# EAGLE schematic stl_mainboard (EAGLE 7.7.0)
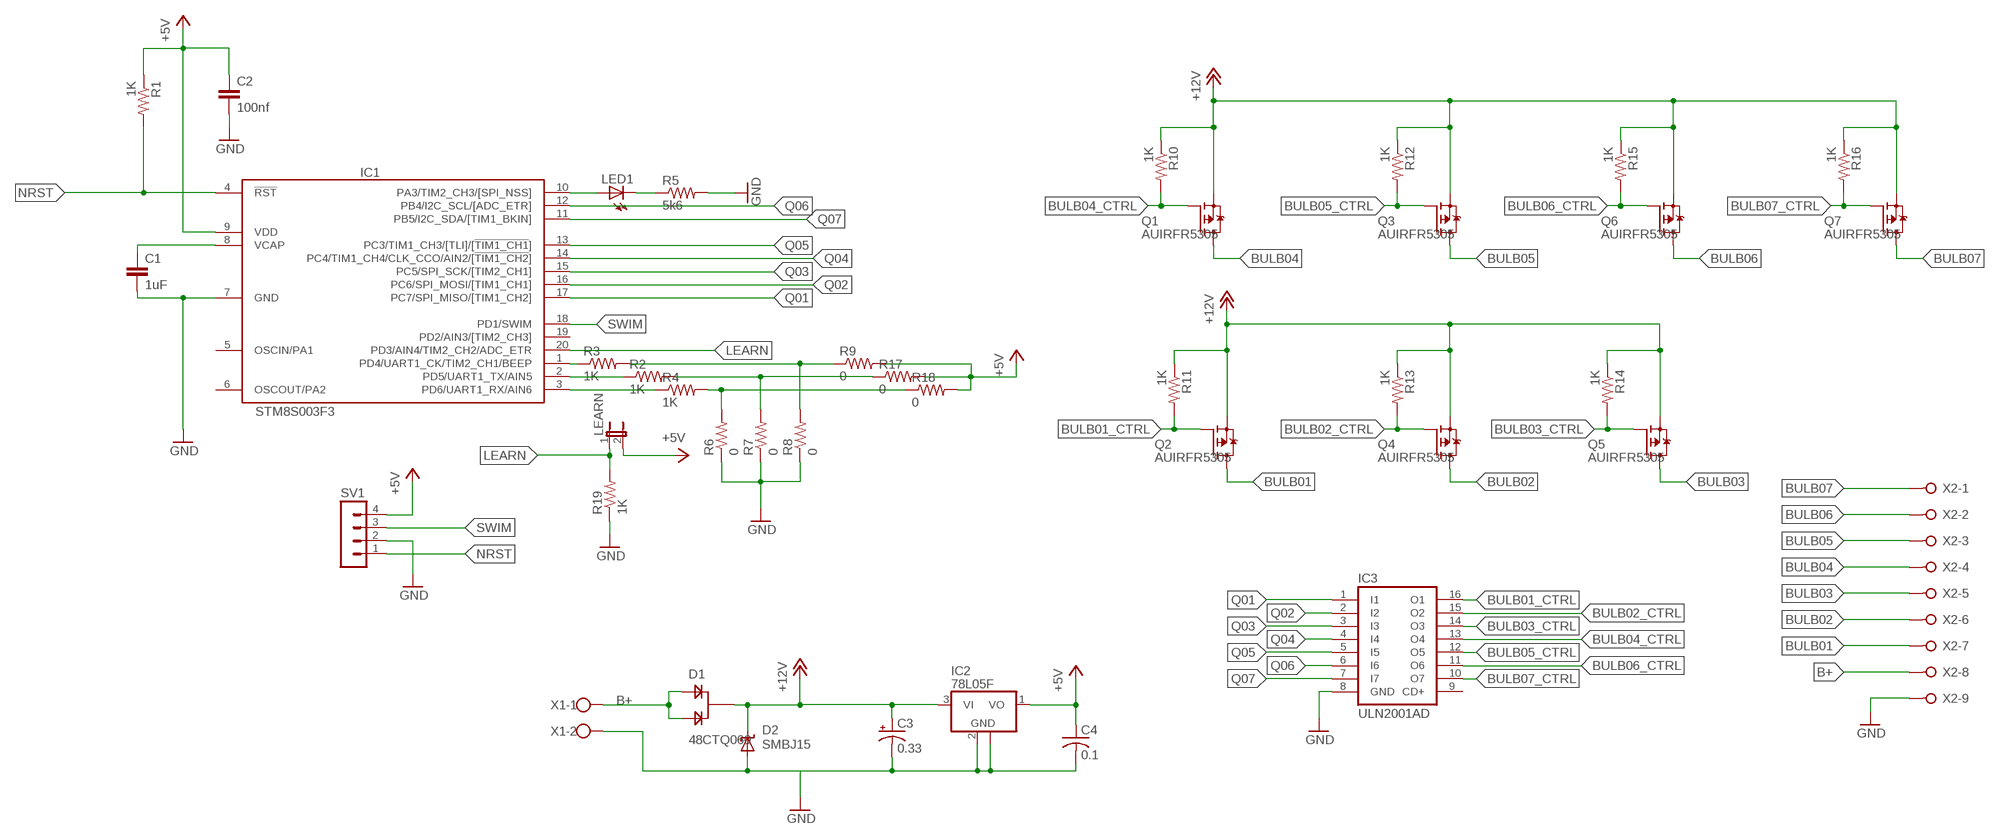
[diagram p0: schematic, sheet 1]

## Parts
C1  1uF  C-EUC1206  [C1206]
C2  100nf  C-EUC1206  [C1206]
C3  0.33  CPOL-USE5-8.5  [E5-8,5]
C4  0.1  C-USC0805  [C0805]
D1  48CTQ060  [TO263AB]
D2  SMBJ15  SUPPRESSOR-SMBJ  [SMBJ]
IC1  STM8S003F3  [TSSOP20]
IC2  78L05F  [SOT89]
IC3  ULN2001AD  [SO16]
LEARN  JP1E  [JP1]
LED1  LEDSML1206  [SML1206]
Q1  AUIRFR5305  SPD30P06PTO252  [TO252]
Q2  AUIRFR5305  SPD30P06PTO252  [TO252]
Q3  AUIRFR5305  SPD30P06PTO252  [TO252]
Q4  AUIRFR5305  SPD30P06PTO252  [TO252]
Q5  AUIRFR5305  SPD30P06PTO252  [TO252]
Q6  AUIRFR5305  SPD30P06PTO252  [TO252]
Q7  AUIRFR5305  SPD30P06PTO252  [TO252]
R1  1K  R-US_M0805  [M0805]
R2  1K  R-US_M0805  [M0805]
R3  1K  R-US_M0805  [M0805]
R4  1K  R-US_M0805  [M0805]
R5  5k6  R-US_M0805  [M0805]
R6  0  R-US_M0805  [M0805]
R7  0  R-US_M0805  [M0805]
R8  0  R-US_M0805  [M0805]
R9  0  R-US_M0805  [M0805]
R10  1K  R-US_M0805  [M0805]
R11  1K  R-US_M0805  [M0805]
R12  1K  R-US_M0805  [M0805]
R13  1K  R-US_M0805  [M0805]
R14  1K  R-US_M0805  [M0805]
R15  1K  R-US_M0805  [M0805]
R16  1K  R-US_M0805  [M0805]
R17  0  R-US_M0805  [M0805]
R18  0  R-US_M0805  [M0805]
R19  1K  R-US_M0805  [M0805]
SV1  MA04-1  [MA04-1]
X1  W237-102  [W237-102]
X2  W237-09P  [W237-9P]

## Nets
+5V: C2.1 C4.1 IC1.9(VDD) IC2.1(VO) LEARN.2 R1.1 R9.2 R17.2 R18.2 SV1.4
B+: D1.1 D1.2 X1.1 X2.8
BULB01: Q2.3(D) X2.7
BULB01_CTRL: IC3.16(O1) Q2.1(G) R11.2
BULB02: Q4.3(D) X2.6
BULB02_CTRL: IC3.15(O2) Q4.1(G) R13.2
BULB03: Q5.3(D) X2.5
BULB03_CTRL: IC3.14(O3) Q5.1(G) R14.2
BULB04: Q1.3(D) X2.4
BULB04_CTRL: IC3.13(O4) Q1.1(G) R10.2
BULB05: Q3.3(D) X2.3
BULB05_CTRL: IC3.12(O5) Q3.1(G) R12.2
BULB06: Q6.3(D) X2.2
BULB06_CTRL: IC3.11(O6) Q6.1(G) R15.2
BULB07: Q7.3(D) X2.1
BULB07_CTRL: IC3.10(O7) Q7.1(G) R16.2
GND: C1.2 C2.2 C3.- C4.2 D2.A IC1.7(GND) IC2.2(GND) IC2.2@1(GND) IC3.8(GND) R5.2 R6.1 R7.1 R8.1 R19.1 SV1.2 X1.2 X2.9
LEARN: IC1.20(PD3/AIN4/TIM2_CH2/ADC_ETR) LEARN.1 R19.2
N$1: IC1.10(PA3/TIM2_CH3/[SPI_NSS]) LED1.A
N$2: LED1.C R5.1
N$3: C1.1 IC1.8(VCAP)
N$5: IC1.1(PD4/UART1_CK/TIM2_CH1/BEEP) R3.1
N$6: IC1.2(PD5/UART1_TX/AIN5) R2.1
N$7: IC1.3(PD6/UART1_RX/AIN6) R4.1
N$8: R3.2 R8.2 R9.1
N$9: R2.2 R7.2 R17.1
N$10: R4.2 R6.2 R18.1
NRST: IC1.4(!RST) R1.2 SV1.1
Q01: IC1.17(PC7/SPI_MISO/[TIM1_CH2]) IC3.1(I1)
Q02: IC1.16(PC6/SPI_MOSI/[TIM1_CH1]) IC3.2(I2)
Q03: IC1.15(PC5/SPI_SCK/[TIM2_CH1]) IC3.3(I3)
Q04: IC1.14(PC4/TIM1_CH4/CLK_CCO/AIN2/[!TIM1_CH2!]) IC3.4(I4)
Q05: IC1.13(PC3/TIM1_CH3/[TLI]/[!TIM1_CH1!]) IC3.5(I5)
Q06: IC1.12(PB4/I2C_SCL/[ADC_ETR]) IC3.6(I6)
Q07: IC1.11(PB5/I2C_SDA/[TIM1_BKIN]) IC3.7(I7)
SWIM: IC1.18(PD1/SWIM) SV1.3
VDD: C3.+ D1.K D2.C IC2.3(VI) Q1.2(S) Q2.2(S) Q3.2(S) Q4.2(S) Q5.2(S) Q6.2(S) Q7.2(S) R10.1 R11.1 R12.1 R13.1 R14.1 R15.1 R16.1 ; supply symbol labelled +12V
Unconnected: IC1.5(OSCIN/PA1) IC1.6(OSCOUT/PA2) IC1.19(PD2/AIN3/[TIM2_CH3]) IC3.9(CD+)

## Library data of the parts
C1 C2 = rcl:C-EU: CAPACITOR, European symbol
C3 = rcl:CPOL-US: POLARIZED CAPACITOR, American symbol
C4 = rcl:C-US: CAPACITOR, American symbol
D1 = 48ctq060:48CTQ060
D2 = diode:SUPPRESSOR-: Suppressor diode
IC1 = stm8:STM8S003: Value line, 16 MHz STM8S 8-bit MCU, 8 Kbytes Flash, 128 bytes data EEPROM, 10-bit ADC, 3 timers, UART, SPI, I2C
IC2 = linear:78L*: POSITOIV-VOLTAGE REGULATORS Output up to 100 mA Source: Datasheet <http://focus.ti.com/lit/ds/symlink/ua78l05.pdf>
IC3 = uln-udn:ULN2001A: DRIVER ARRAY
LEARN = jumper:JP1E: JUMPER
LED1 = led:LED: LED OSRAM: - CHIPLED LG R971, LG N971, LY N971, LG Q971, LY Q971, LO R971, LY R971 LH N974, LH R974 LS Q976, LO Q976, LY Q976 LO Q996 - Hyper CHIPLED LW Q18S LB Q993, LB Q99A, LB R99A - SideLED LS A670, LO A670, LY A670, LG A670, LP A670 LB A673, LV A673, LT A673, LW A673 LH A674 LY A675 LS A676, LA A676, LO A676, LY A676, LW A676 LS A679, LY A679, LG A679 - Hyper Micro SIDELED® LS Y876, LA Y876, LO Y876, LY Y876 LT Y87S - SmartLED LW L88C, LW L88S LB L89C, LB L89S, LG L890 LS L89K, LO L89K, LY L89K LS L896, LA L896, LO L896, LY L896 - TOPLED LS T670, LO T670, LY T670, LG T670, LP T670 LSG T670, LSP T670, LSY T670, LOP T670, LYG T670 LG T671, LOG T671, LSG T671 LB T673, LV T673, LT T673, LW T673 LH T674 LS T676, LA T676, LO T676, LY T676, LB T676, LH T676, LSB T676, LW T676 LB T67C, LV T67C, LT T67C, LS T67K, LO T67K, LY T67K, LW E67C LS E67B, LA E67B, LO E67B, LY E67B, LB E67C, LV E67C, LT E67C LW T67C LS T679, LY T679, LG T679 LS T770, LO T770, LY T770, LG T770, LP T770 LB T773, LV T773, LT T773, LW T773 LH T774 LS E675, LA E675, LY E675, LS T675 LS T776, LA T776, LO T776, LY T776, LB T776 LHGB T686 LT T68C, LB T68C - Hyper Mini TOPLED® LB M676 - Mini TOPLED Santana® LG M470 LS M47K, LO M47K, LY M47K Source: http://www.osram.convergy.de LUXEON: - LUMILED® LXK2-PW12-R00, LXK2-PW12-S00, LXK2-PW14-U00, LXK2-PW14-V00 LXK2-PM12-R00, LXK2-PM12-S00, LXK2-PM14-U00 LXK2-PE12-Q00, LXK2-PE12-R00, LXK2-PE12-S00, LXK2-PE14-T00, LXK2-PE14-U00 LXK2-PB12-K00, LXK2-PB12-L00, LXK2-PB12-M00, LXK2-PB14-N00, LXK2-PB14-P00, LXK2-PB14-Q00 LXK2-PR12-L00, LXK2-PR12-M00, LXK2-PR14-Q00, LXK2-PR14-R00 LXK2-PD12-Q00, LXK2-PD12-R00, LXK2-PD12-S00 LXK2-PH12-R00, LXK2-PH12-S00 LXK2-PL12-P00, LXK2-PL12-Q00, LXK2-PL12-R00 Source: www.luxeon.com KINGBRIGHT: KA-3528ASYC Source: www.kingbright.com
Q1-Q7 = transistor-fet:SPD30P06P: SIPMOS(R) Power-Transistor P-Channel, Enhancement mode Source: http://www.infineon.com/upload/Document/cmc_upload/documents/012/3615/SPD_U30P06P.pdf
R1-R19 = rcl:R-US_: RESISTOR, American symbol
SV1 = con-lstb:MA04-1: PIN HEADER; OC_FARNELL: unknown; OC_NEWARK: unknown
X1 = con-wago-500:W237-102: WAGO SCREW CLAMP; MPN: 237-102; OC_FARNELL: unknown; OC_NEWARK: 70K9898
X2 = con-wago-508:W237-09P: WAGO SREW CLAMP; OC_FARNELL: unknown; OC_NEWARK: unknown